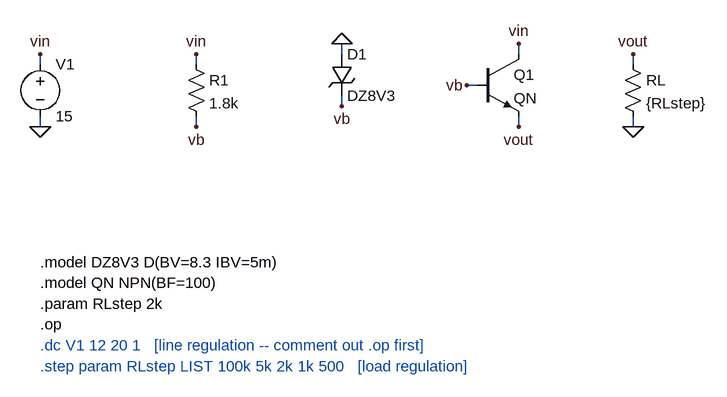
[diagram p0: schematic series_regulator_experiment.asc]
series_regulator_experiment.asc, the LTspice schematic file:
Version 4.1
SHEET 1 1152 808
SYMBOL voltage 112 160 R0
SYMATTR InstName V1
SYMATTR Value 15
SYMBOL res 336 160 R0
SYMATTR InstName R1
SYMATTR Value 1.8k
SYMBOL zener 560 160 R0
SYMATTR InstName D1
SYMATTR Value DZ8V3
SYMBOL npn 784 160 R0
SYMATTR InstName Q1
SYMATTR Value QN
SYMBOL res 1008 160 R0
SYMATTR InstName RL
SYMATTR Value {RLstep}
WIRE 112 176 112 160
WIRE 352 176 352 160
WIRE 848 160 848 144
WIRE 352 256 352 272
WIRE 576 224 576 240
WIRE 784 208 768 208
WIRE 848 256 848 272
WIRE 1024 176 1024 160
WIRE 112 256 112 272
WIRE 576 160 576 144
WIRE 1024 256 1024 272
FLAG 112 160 vin
FLAG 352 160 vin
FLAG 848 144 vin
FLAG 352 272 vb
FLAG 576 240 vb
FLAG 768 208 vb
FLAG 848 272 vout
FLAG 1024 160 vout
FLAG 112 272 0
FLAG 576 144 0
FLAG 1024 272 0
TEXT 112 480 Left 2 !.model DZ8V3 D(BV=8.3 IBV=5m)
TEXT 112 512 Left 2 !.model QN NPN(BF=100)
TEXT 112 544 Left 2 !.param RLstep 2k
TEXT 112 576 Left 2 !.op
TEXT 112 608 Left 2 ;.dc V1 12 20 1   [line regulation -- comment out .op first]
TEXT 112 640 Left 2 ;.step param RLstep LIST 100k 5k 2k 1k 500   [load regulation]

The netlist it stands for:
* series_regulator_experiment.asc
V1 vin 0 15
R1 vin vb 1.8k
D1 0 vb DZ8V3
Q1 vin vb vout 0 QN
RL vout 0 {RLstep}
.model D D
.lib standard.dio
.model NPN NPN
.model PNP PNP
.lib standard.bjt
.model DZ8V3 D(BV=8.3 IBV=5m)
.model QN NPN(BF=100)
.param RLstep 2k
.op
* .dc V1 12 20 1   [line regulation -- comment out .op first]
* .step param RLstep LIST 100k 5k 2k 1k 500   [load regulation]
.backanno
.end